# Altium schematic sheet Sheet1.SchDoc
size A4; SheetNumber: 1; SheetTotal: 1
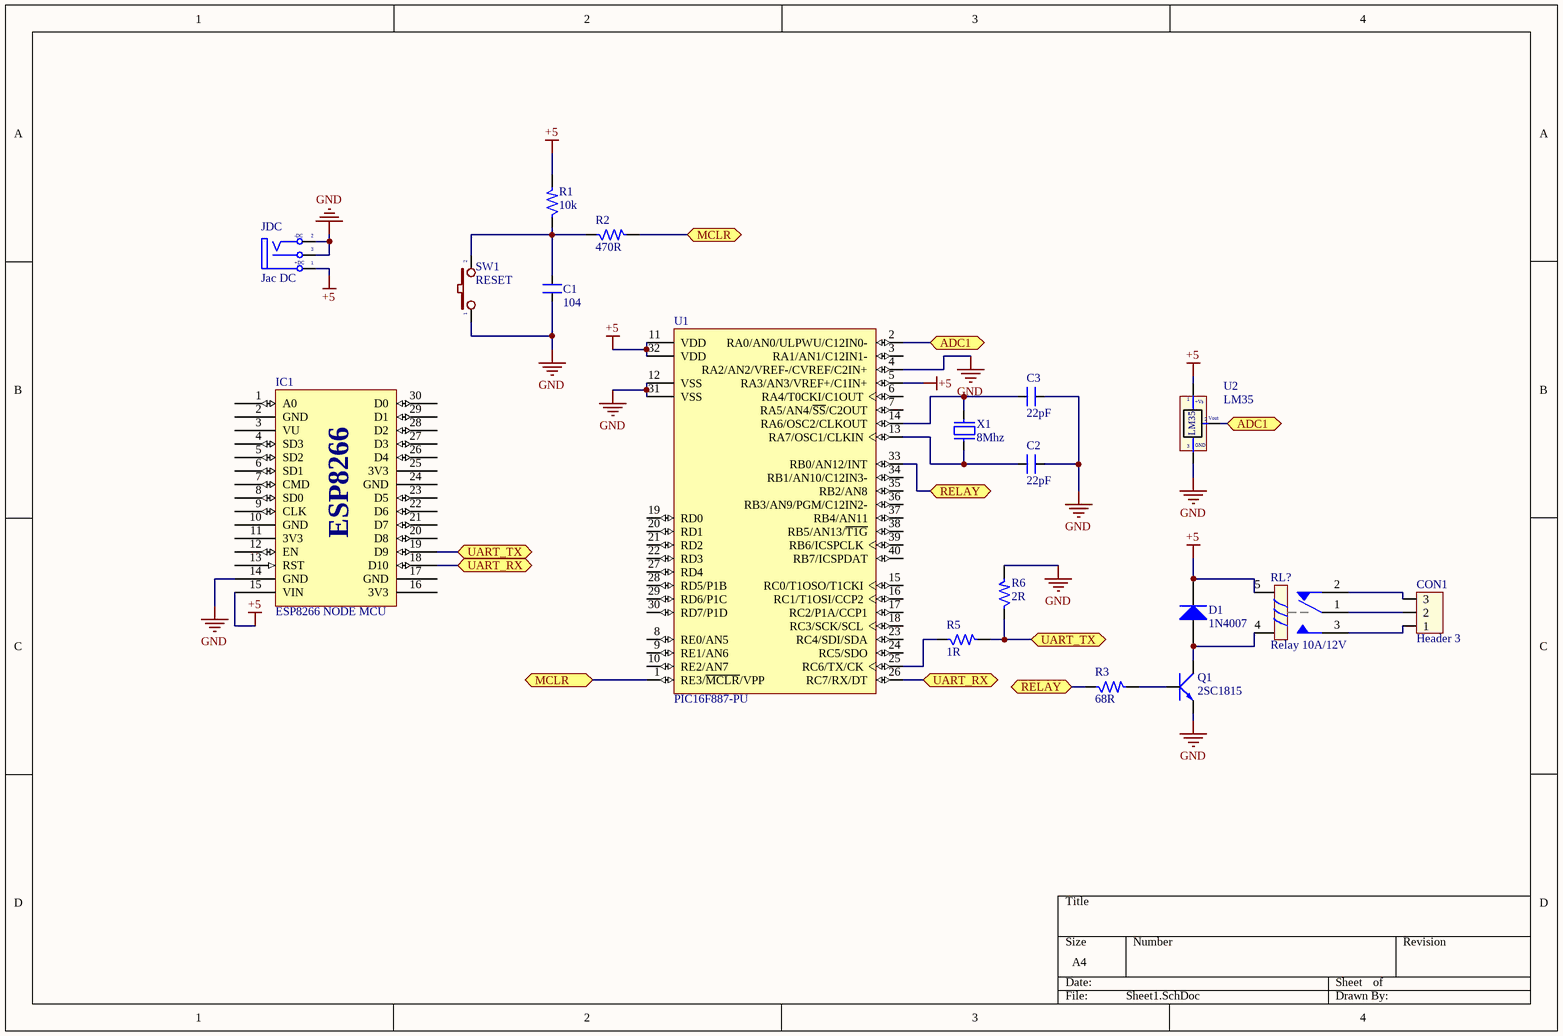
[diagram p0: Sheet1.SchDoc]

## Parts
C1  104  [CN2]
C2  22pF  [CN1]
C3  22pF  [CN1]
CON1  Header 3  [HED3B]
D1  1N4007  [DO-41]
IC1  ESP8266 NODE MCU  [ESP8266 NodeMCU]
JDC  Jac DC  [DC-IN]
Q1  2SC1815  [TO92-123]
R1  10k  [R1/4W]
R2  470R  [R1/4W]
R3  68R  [R1/4W]
R5  1R  [R1/4W]
R6  2R  [R1/4W]
RL?  Relay 10A/12V  [RELAY 5]
SW1  RESET  [SW2]
U1  PIC16F887-PU  [DIP40/W0.6]
U2  LM35  [TO92-123]
X1  8Mhz  [XT2]

## Ports
ADC1 (bidir), MCLR (bidir), RELAY (bidir), UART_RX (bidir), UART_TX (bidir)

## Nets
+5: D1.2(K) IC1.15(VIN) JDC.1(T) R1.2 RL?.5 U1.5(RA3/AN3/VREF+/C1IN+) U1.11(VDD) U1.32(VDD) U2.1(+Vs)
GND: C1.1 C2.2 C3.2 IC1.14(GND) JDC.2(TN) JDC.3(S) Q1.1(E) R6.2 SW1.1 U1.4(RA2/AN2/VREF-/CVREF/C2IN+) U1.12(VSS) U1.31(VSS) U2.3(-)
ADC1: U1.2(RA0/AN0/ULPWU/C12IN0-) U2.2(Vout) ; port ADC1
MCLR: R2.2 U1.1(RE3/~{MCLR}/VPP) ; port MCLR
RELAY: R3.1 U1.33(RB0/AN12/INT) ; port RELAY
UART_RX: IC1.18(D10) U1.26(RC7/RX/DT) ; port UART_RX
UART_TX: IC1.19(D9) R5.2 R6.1 ; port UART_TX
NetC1_2: C1.2 R1.1 R2.1 SW1.2
NetC2_1: C2.1 U1.13(RA7/OSC1/CLKIN) X1.1
NetC3_1: C3.1 U1.14(RA6/OSC2/CLKOUT) X1.2
NetCON1_1: CON1.1 RL?.3
NetCON1_2: CON1.2 RL?.1
NetCON1_3: CON1.3 RL?.2
NetD1_1: D1.1(A) Q1.2(C) RL?.4
NetQ1_3: Q1.3(B) R3.2
NetR5_1: R5.1 U1.25(RC6/TX/CK)

Not connected (* = marked no-connect by the designer): IC1 1(A0) 2(GND) 3(VU) 4(SD3) 5(SD2) 6(SD1) 7(CMD) 8(SD0) 9(CLK) 10(GND) 11(3V3) 12(EN) 13(RST) 16(3V3) 17(GND) 20(D8) 21(D7) 22(D6) 23(D5) 24(GND) 25(3V3) 26(D4) 27(D3) 28(D2) 29(D1) 30(D0); U1 3(RA1/AN1/C12IN1-) 6(RA4/T0CKI/C1OUT) 7(RA5/AN4/~{SS}/C2OUT) 8(RE0/AN5) 9(RE1/AN6) 10(RE2/AN7) 15(RC0/T1OSO/T1CKI) 16(RC1/T1OSI/CCP2) 17(RC2/P1A/CCP1) 18(RC3/SCK/SCL) 19(RD0) 20(RD1) 21(RD2) 22(RD3) 23(RC4/SDI/SDA) 24(RC5/SDO) 27(RD4) 28(RD5/P1B) 29(RD6/P1C) 30(RD7/P1D) 34(RB1/AN10/C12IN3-) 35(RB2/AN8) 36(RB3/AN9/PGM/C12IN2-) 37(RB4/AN11) 38(RB5/AN13/~{T1G}) 39(RB6/ICSPCLK) 40(RB7/ICSPDAT)

## Notes on the sheet
- (in symbol DCIN) -DC; +DC
- (in symbol ESP8266 NodeMCU) ESP8266
- (in symbol LM35) GND

## Library data of the parts
C1 = CN2: Cap np 104 => 105pF; Value: 0.1uF
C2 C3 = CN0: Cremic For Xtal 1pF => 100pF; Value: 33pF
CON1 = Hed3: Header 3 (Green); Value: Header 3
D1 = Diode 1N4007: 1 Amp General Purpose Rectifier; Published: 8-Jun-2000; LatestRevisionDate: 17-Jul-2002; LatestRevisionNote: Re-released for DXP Platform.; DatasheetVersion: 1998; PackageVersion: Aug-1999; PackageReference: DO-41; Publisher: Altium Limited; PackageDescription: Diode, Axial; Body 5.2 x 2.7 mm (LxDia. max), Lead Dia. 0.86 mm (max); Code_JEDEC: DO-204-AL; ComponentLink1Description: Manufacturer Link; ComponentLink1URL: http://www.fairchildsemi.com/; ComponentLink2Description: Datasheet; ComponentLink2URL: http://www.fairchildsemi.com/ds/1N%2F1N4001.pdf
IC1 = ESP8266 NodeMCU: LUA-ESP8266 Wifi Module Techmt.vn
JDC = DCIN: Jac DC input; Value: Jac DC
Q1 = 2SC1815: NPN 600mW, ECB; Value: C1815
R1-R3 R5 R6 = R: Resistor 1/4W; Value: R1/4W - 1K
RL? = Relay 5: Relay SPDT,10A - 12VDC 5 Pin; Value: Relay SPDT, 10A, 12V
SW1 = SW2: Switch button 2 pin; Value: SW chip 2 pin
U1 = PIC16F887-PU: Flash-Based, 8-Bit CMOS Microcontroller with nanoWatt Technology, 8K (x14-Bit words) Program Memory, 624 Bytes Data Memory, 35 I/O pins, 40-Pin PDIP, Standard VDD Range, Extended Temperature; Published: 29-Jan-2009; LatestRevisionDate: 02-Dec-2009; LatestRevisionNote: Updated datasheet to version revF, Apr-2009.; DatasheetVersion: revF, Apr-2009; PackageVersion: revBB, Aug-2009; PackageReference: PDIP600-P40; Publisher: Altium Limited; PackageDescription: 40-Lead Plastic Dual In-Line (P) - 600 mil Body [PDIP]; Supplier 1: Digi-Key; Supplier Part Number 1: PIC16F887-E/P-ND; Supplier 2: Farnell; Supplier Part Number 2: 1703423; ComponentLink1Description: Datasheet; ComponentLink1URL: http://ww1.microchip.com/downloads/en/DeviceDoc/41291F.pdf; ComponentLink2Description: Packaging Specification; ComponentLink2URL: http://www.microchip.com/stellent/groups/techpub_sg/documents/packagingspec/en012702.pdf; ComponentLink3Description: Microchip.com Home; ComponentLink3URL: http://www.microchip.com/
U2 = LM35: Teminal; Value: LM35
X1 = XT2: Crystal For all Crystal 2pin.; Value: 4Mhz